# EAGLE design fan_control_unit (EAGLE 8.2.0)
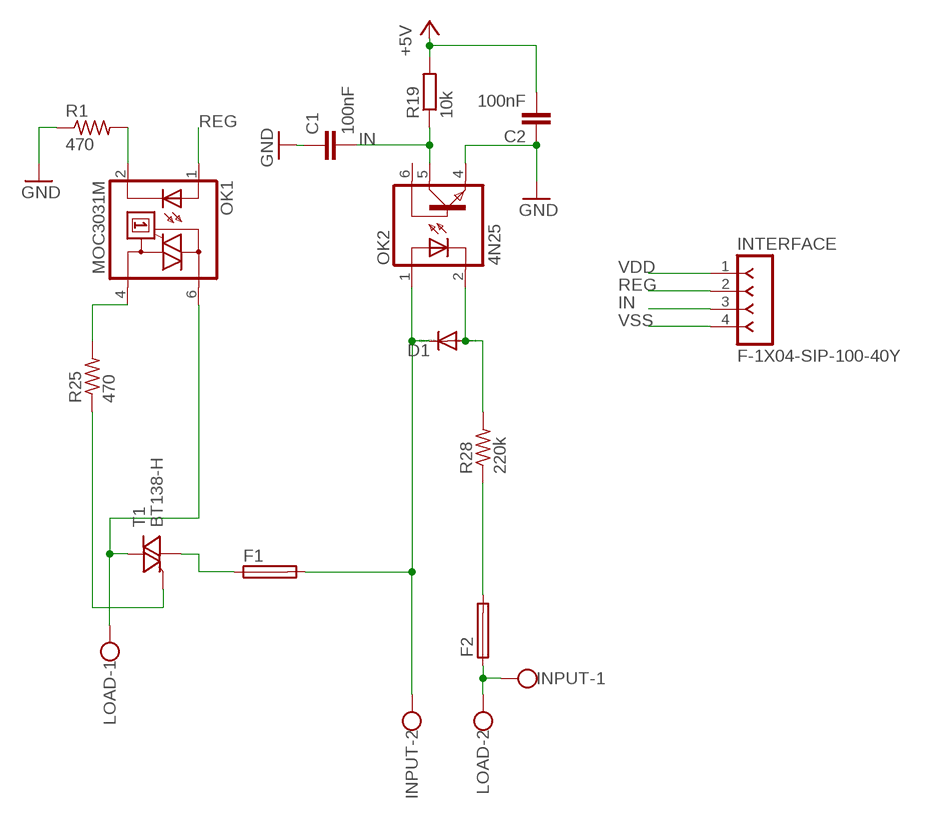
[diagram p0: schematic, sheet 1]

## Parts
C1  100nF  C-EUC1206  [C1206]
C2  100nF  C-EUC1206  [C1206]
D1  1N4148DO35-7  [DO35-7]
F1  SH22,5A  [SH22,5A]
F2  SH22,5A  [SH22,5A]
INPUT  W237-102  [W237-102]
INTERFACE  F-1X04-SIP-100-40Y  [SIP-100-04-40Y]
LOAD  W237-102  [W237-102]
OK1  MOC3031M  [DIL06]
OK2  4N25  4N35  [DIL06]
R1  470  R-US_0207/15  [0207/15]
R19  10k  R-EU_R1206  [R1206]
R25  470  R-US_0207/15  [0207/15]
R28  220k  R-US_0207/15  [0207/15]
T1  BT138-H  [TO220BH]

## Nets
GATE: R25.1 T1.G
IN: C1.2 INTERFACE.3 OK2.5(COL) R19.1
N$1: F1.1 T1.T1(A1)
N$2: F2.2 R28.1
N$3: F2.1 INPUT.1 LOAD.2
N$4: OK1.4(A1) R25.2
N$5: OK1.2(C) R1.2
N$7: D1.A OK2.2(C) R28.2
N$28: LOAD.1 OK1.6(A2) T1.T2(A2)
N$40: D1.C F1.2 INPUT.2 OK2.1(A)
REG: INTERFACE.2 OK1.1(A)
VDD: C2.2 INTERFACE.1 R19.2 ; supply symbol labelled +5V
VSS: C1.1 C2.1 INTERFACE.4 OK2.4(EMI) R1.1 ; supply symbol labelled GND
Unconnected: OK2.6(BAS)

## Library data of the parts
C1 C2 = rcl:C-EU: CAPACITOR, European symbol
D1 = diode:1N4148: DIODE high speed (Philips)
F1 F2 = fuse:SH22,5A: FUSE HOLDER grid 22,5mm, isolated cap OGN0031 8201, Schurter (Buerklin); MPN: 0031.7701.11; OC_FARNELL: unknown; OC_NEWARK: 04F1224
INPUT LOAD = con-wago-500:W237-102: WAGO SCREW CLAMP; MPN: 237-102; OC_FARNELL: unknown; OC_NEWARK: 70K9898
INTERFACE = con-headers-jp:F-1X04-: FEMALE HEADER
OK1 = optocoupler:MOC30*: 6-Pin DIP Zero-Cross Optoisolators Triac Driver Output (250/400 Volt Peak) Source: Data sheet <http://www.fairchildsemi.com/ds/MO/MOC3031M.pdf> The old path of data sheet not more available 2013-05-06.; MF: FAIRCHILD SEMICONDUCTOR; MPN: MOC3031M; OC_FARNELL: 9875964; OC_NEWARK: 78K6089
OK2 = optocoupler:4N35: MOTOROLA OPTO COUPLER; MF: FAIRCHILD SEMICONDUCTOR; MPN: 4N35; OC_FARNELL: 1328375; OC_NEWARK: 72K9946
R1 R25 R28 = rcl:R-US_: RESISTOR, American symbol
R19 = rcl:R-EU_: RESISTOR, European symbol
T1 = triac:BT138: TRIAC Source: http://www.semiconductors.philips.com BT138_SERIES_2.pdf

## Board
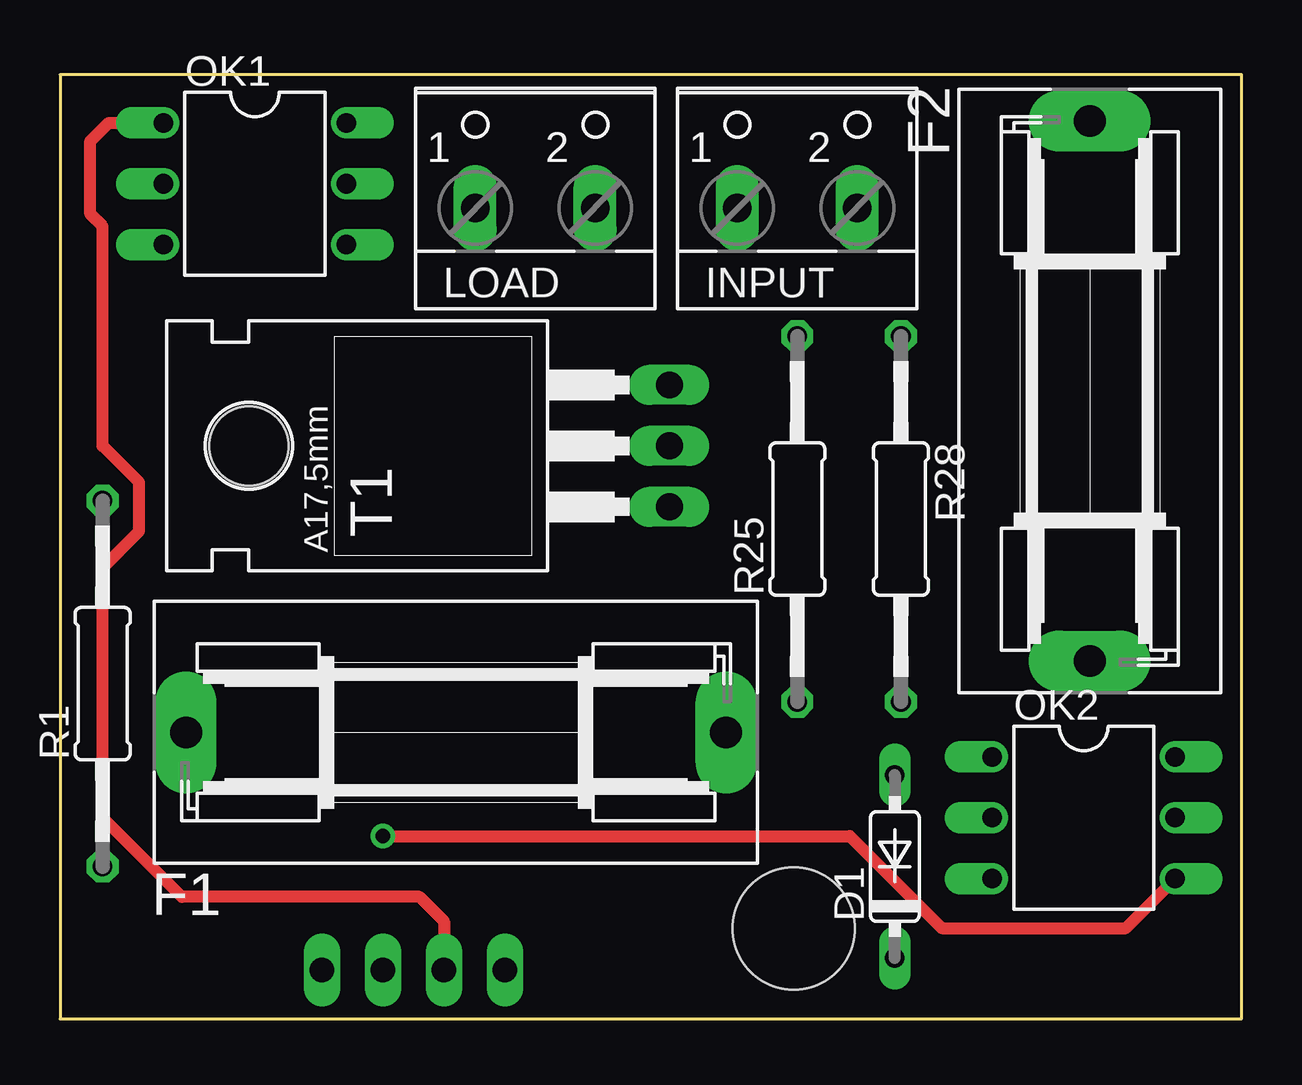
[diagram p1: board, top side]
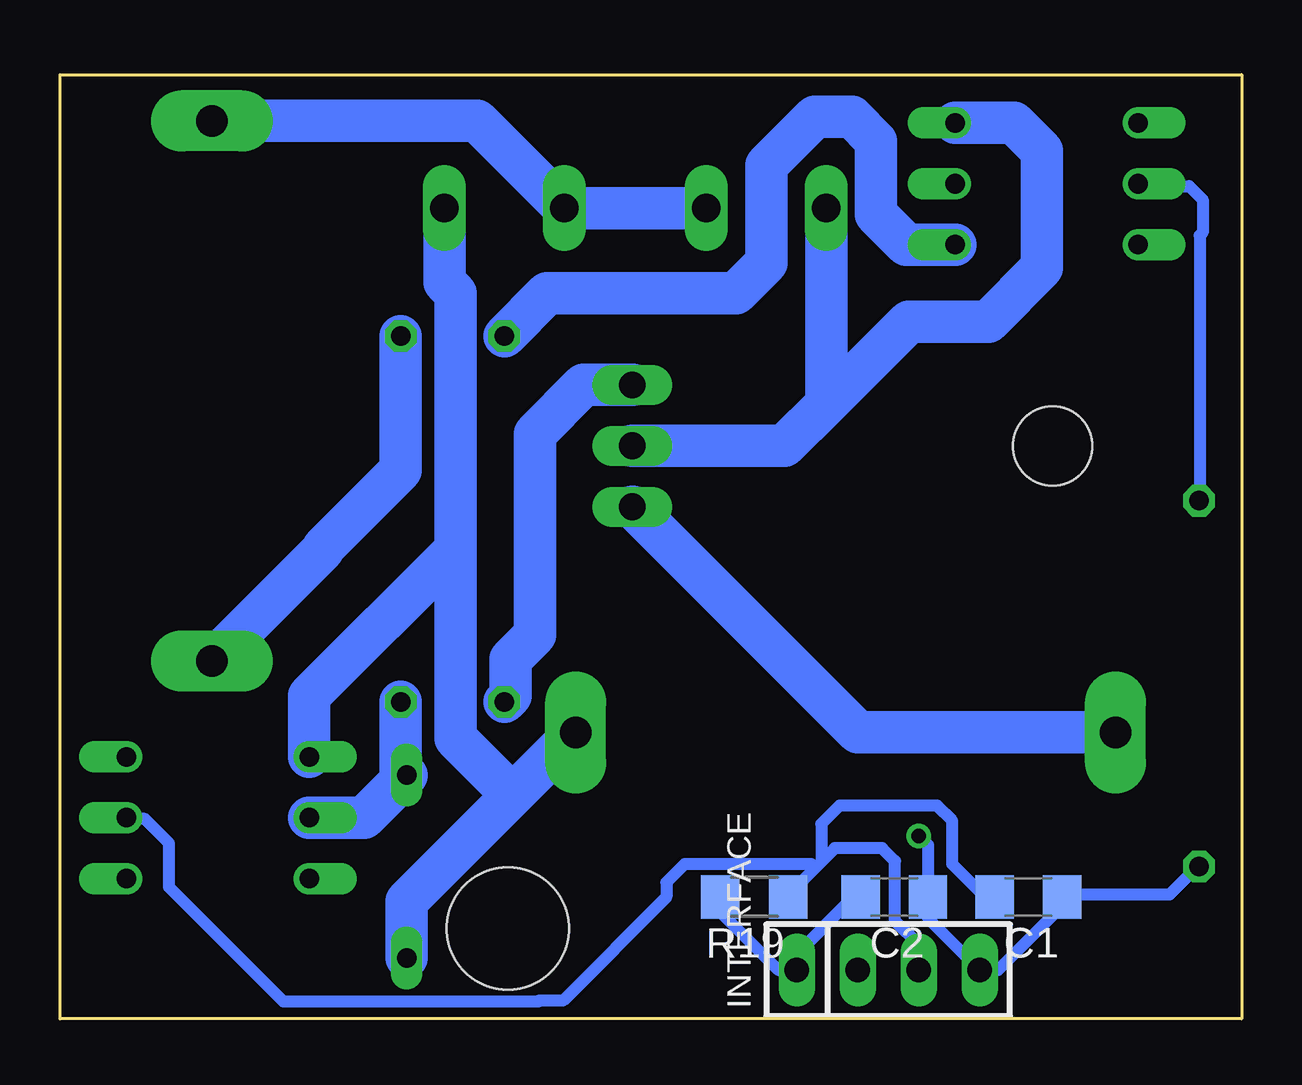
[diagram p2: board, bottom side, seen from below]

Size 49.26 x 39.34 mm. Coordinates in mm from the lower left corner, seen from the top.
Outline: 0,0 49.26,0 49.26,39.34 0,39.34 0,0
Copper layers (1*16): Top 0.035mm / dielectric 1.5mm / Bottom 0.035mm
Design rules "default *": minimum track width 20mil, minimum drill 24mil, track to track 8mil, track to pad 8mil, pad to pad 8mil, via to via 8mil, smd to smd 8mil, copper to edge 10mil, drill to drill 8mil, minimum pad ring 10mil, minimum via ring 8mil, stop-mask expansion 4mil, vias tented up to drill 0mil, thermal gap 10mil
Holes 5.08 mm at 30.59,3.77

### Footprints (pad centres in the part's own frame; a part is rotated, then mirrored left to right if it is on the bottom)
C1206 = smd 1.6 x 1.8: 1 -1.4,0; 2 1.4,0
DO35-7 = drill 0.813 long: A 3.81,0; C -3.81,0
SH22,5A = drill 1.321 pad 2.54 long: 1 -11.252,0; 2 11.252,0
W237-102 = drill 1.194 long: 1 -2.5,-1.27; 2 2.5,-1.27
SIP-100-04-40Y = drill 1.016 long: 1 -3.81,0; 2 -1.27,0; 3 1.27,0; 4 3.81,0
DIL06 = drill 0.813 offset: 1 -2.54,-3.81; 2 0,-3.81; 3 2.54,-3.81; 4 2.54,3.81; 5 0,3.81; 6 -2.54,3.81
0207/15 = drill 0.813 octagon: 1 -7.62,0; 2 7.62,0
R1206 = smd 1.6 x 1.803: 1 -1.422,0; 2 1.422,0
TO220BH = drill 1.118 long: G 2.54,-6.35; T1 -2.54,-6.35; T2 0,-6.35 | hole 3.302: 0,11.176

### Placement (x,y rotation side)
C1  8.89,5.08 180 bottom
C2  14.48,5.08 180 bottom
D1  34.8,6.35 90 top
F1  16.51,11.94 0 top
F2  42.93,26.16 270 top
INPUT  30.73,35.05 0 top
INTERFACE  14.73,2.03 0 bottom
LOAD  19.81,35.05 0 top
OK1  8.13,34.8 270 top
OK2  42.67,8.38 270 top
R1  1.78,13.97 90 top
R19  20.32,5.08 180 bottom
R25  30.73,20.83 90 top
R28  35.05,20.83 270 top
T1  19.05,23.88 90 top

### Tracks (layer width: path | path; a pad name or v marks a point on that pad's centre or on a via)
GATE
  Bottom 1.778: T1.G 27.43,26.42 29.46,24.38 29.46,16 30.48,14.99 30.48,13.46 R25.1
IN
  Bottom 0.508: 17.78,6.29 18.89,5.17 R19.1 | 17.78,6.29 17.53,6.54 | C1.2 10.32,5.17 10.79,5.17 12.06,6.45 12.06,8.26 12.7,8.89 16.76,8.89 17.53,8.13 17.53,6.54 | 46.35,8.35 OK2.5 46.43,8.33 45.72,8.33 44.7,7.32 44.7,5.49 39.94,0.72 29.32,0.72 29.28,0.76 28.3,0.76 23.98,5.08 23.98,5.69 23.22,6.45 17.94,6.45 17.78,6.29 | 17.53,6.54 16.95,7.11 14.99,7.11 14.45,6.57 14.45,4.06 13.46,3.08 INTERFACE.3
N$1
  Bottom 1.778: F1.1 16,11.94 T1.T1
N$2
  Bottom 1.778: F2.2 38.28,19.56 38.28,19.63 35.05,22.86 R28.1
N$3
  Bottom 1.778: F2.1 31.87,37.41 INPUT.1 LOAD.2
N$4
  Bottom 1.778: R25.2 28.96,30.23 21.08,30.23 19.81,31.5 19.81,35.56 17.78,37.59 16.26,37.59 15.24,36.58 15.24,33.53 13.97,32.26 OK1.4
N$5
  Bottom 0.508: R1.2 1.75,21.68 1.75,32.64 1.63,32.76 1.63,34.14 2.19,34.7 4.29,34.7 OK1.2
N$7
  Bottom 1.778: R28.2 35.05,10.41 | 35.05,10.41 D1.A | 35.05,10.41 35.05,9.91 36.58,8.38 OK2.2
N$28
  Bottom 1.778: LOAD.1 17.31,25.61 | 17.31,25.61 19.05,23.88 T1.T2 | OK1.6 9.5,37.34 8.33,36.17 8.33,31.29 10.57,29.06 13.87,29.06 17.31,25.61
N$40
  Bottom 1.778: D1.C 34.8,4.9 30.39,9.31 | 30.39,9.31 F1.2 | INPUT.2 33.23,30.69 32.77,30.23 32.77,19.56 | 32.77,19.56 32.77,11.68 30.39,9.31 | OK2.1 38.86,13.46 32.77,19.56
REG
  Top 0.508: OK1.1 2.03,37.34 1.27,36.58 1.27,33.53 1.78,33.02 1.78,23.88 3.3,22.35 3.3,20.32 1.78,18.8 1.78,8.38 5.08,5.08 14.99,5.08 16,4.06 INTERFACE.2
VDD
  Bottom 0.508: 16.03,4.54 16.03,5.02 C2.2 16.18,5.08 18.57,2.69 18.57,2.06 | 21.59,5.02 R19.2 21.74,4.47 19.3,2.03 18.59,2.03 18.57,2.06 | 18.57,2.06 INTERFACE.1
VSS  (via drill 0.61)
  Top 0.508: OK2.4 44.42,3.79 36.75,3.79 32.92,7.62 v13.46,7.62
  Bottom 0.508: v13.46,7.62 13.08,7.24 C2.1 13.08,4.19 INTERFACE.4 10.16,2.03 7.49,4.7 C1.1 7.49,5.15 7.46,5.17 3.02,5.17 1.91,6.29 R1.1